# Altium project Warship_stm32f103zet6.PrjPcb
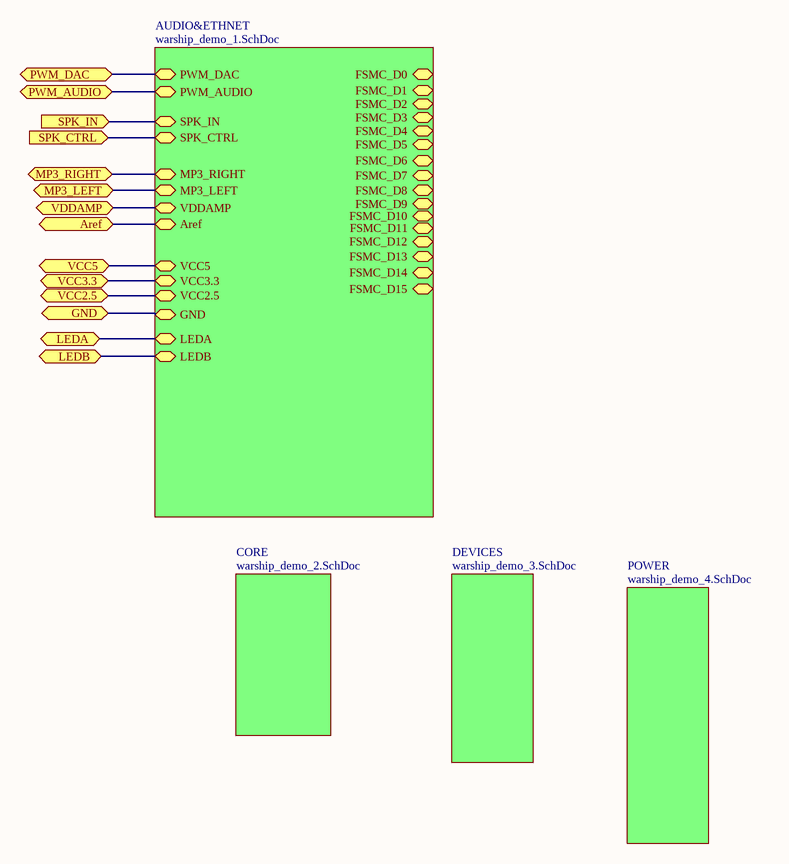
[diagram p0: top.SchDoc]
2 sheets, 53 parts. Net scope: global (net labels, ports and power ports of the same name join across sheets).
Board file: warship_demo_PCB.PcbDoc
Sheets:
  top.SchDoc
    CORE = warship_demo_2.SchDoc

## Sheet top.SchDoc
size A4

### Sub-sheets
AUDIO&ETHNET = warship_demo_1.SchDoc (file not in this document): PWM_DAC, PWM_AUDIO, SPK_IN, SPK_CTRL, MP3_RIGHT, MP3_LEFT, VDDAMP, Aref, VCC5, VCC3.3, VCC2.5, GND, LEDB, LEDA, FSMC_D0, FSMC_D1, FSMC_D2, FSMC_D3, FSMC_D4, FSMC_D5, FSMC_D6, FSMC_D7, FSMC_D8, FSMC_D9, FSMC_D10, FSMC_D11, FSMC_D12, FSMC_D13, FSMC_D14, FSMC_D15
CORE = warship_demo_2.SchDoc: no entries
DEVICES = warship_demo_3.SchDoc (file not in this document): no entries
POWER = warship_demo_4.SchDoc (file not in this document): no entries

### Ports
Aref, GND, LEDA, LEDB, MP3_LEFT, MP3_RIGHT, PWM_AUDIO, PWM_DAC, SPK_CTRL (in), SPK_IN (in), VCC2.5, VCC3.3, VCC5, VDDAMP

### Nets
(unnamed): port PWM_DAC, sheet AUDIO&ETHNET/PWM_DAC
(unnamed): port PWM_AUDIO, sheet AUDIO&ETHNET/PWM_AUDIO
(unnamed): port SPK_IN, sheet AUDIO&ETHNET/SPK_IN
(unnamed): port SPK_CTRL, sheet AUDIO&ETHNET/SPK_CTRL
(unnamed): port MP3_RIGHT, sheet AUDIO&ETHNET/MP3_RIGHT
(unnamed): port MP3_LEFT, sheet AUDIO&ETHNET/MP3_LEFT
(unnamed): port VDDAMP, sheet AUDIO&ETHNET/VDDAMP
(unnamed): port Aref, sheet AUDIO&ETHNET/Aref
(unnamed): port VCC5, sheet AUDIO&ETHNET/VCC5
(unnamed): port VCC3.3, sheet AUDIO&ETHNET/VCC3.3
(unnamed): port VCC2.5, sheet AUDIO&ETHNET/VCC2.5
(unnamed): port GND, sheet AUDIO&ETHNET/GND
(unnamed): port LEDA, sheet AUDIO&ETHNET/LEDA
(unnamed): port LEDB, sheet AUDIO&ETHNET/LEDB

## Sheet warship_demo_2.SchDoc
size A3
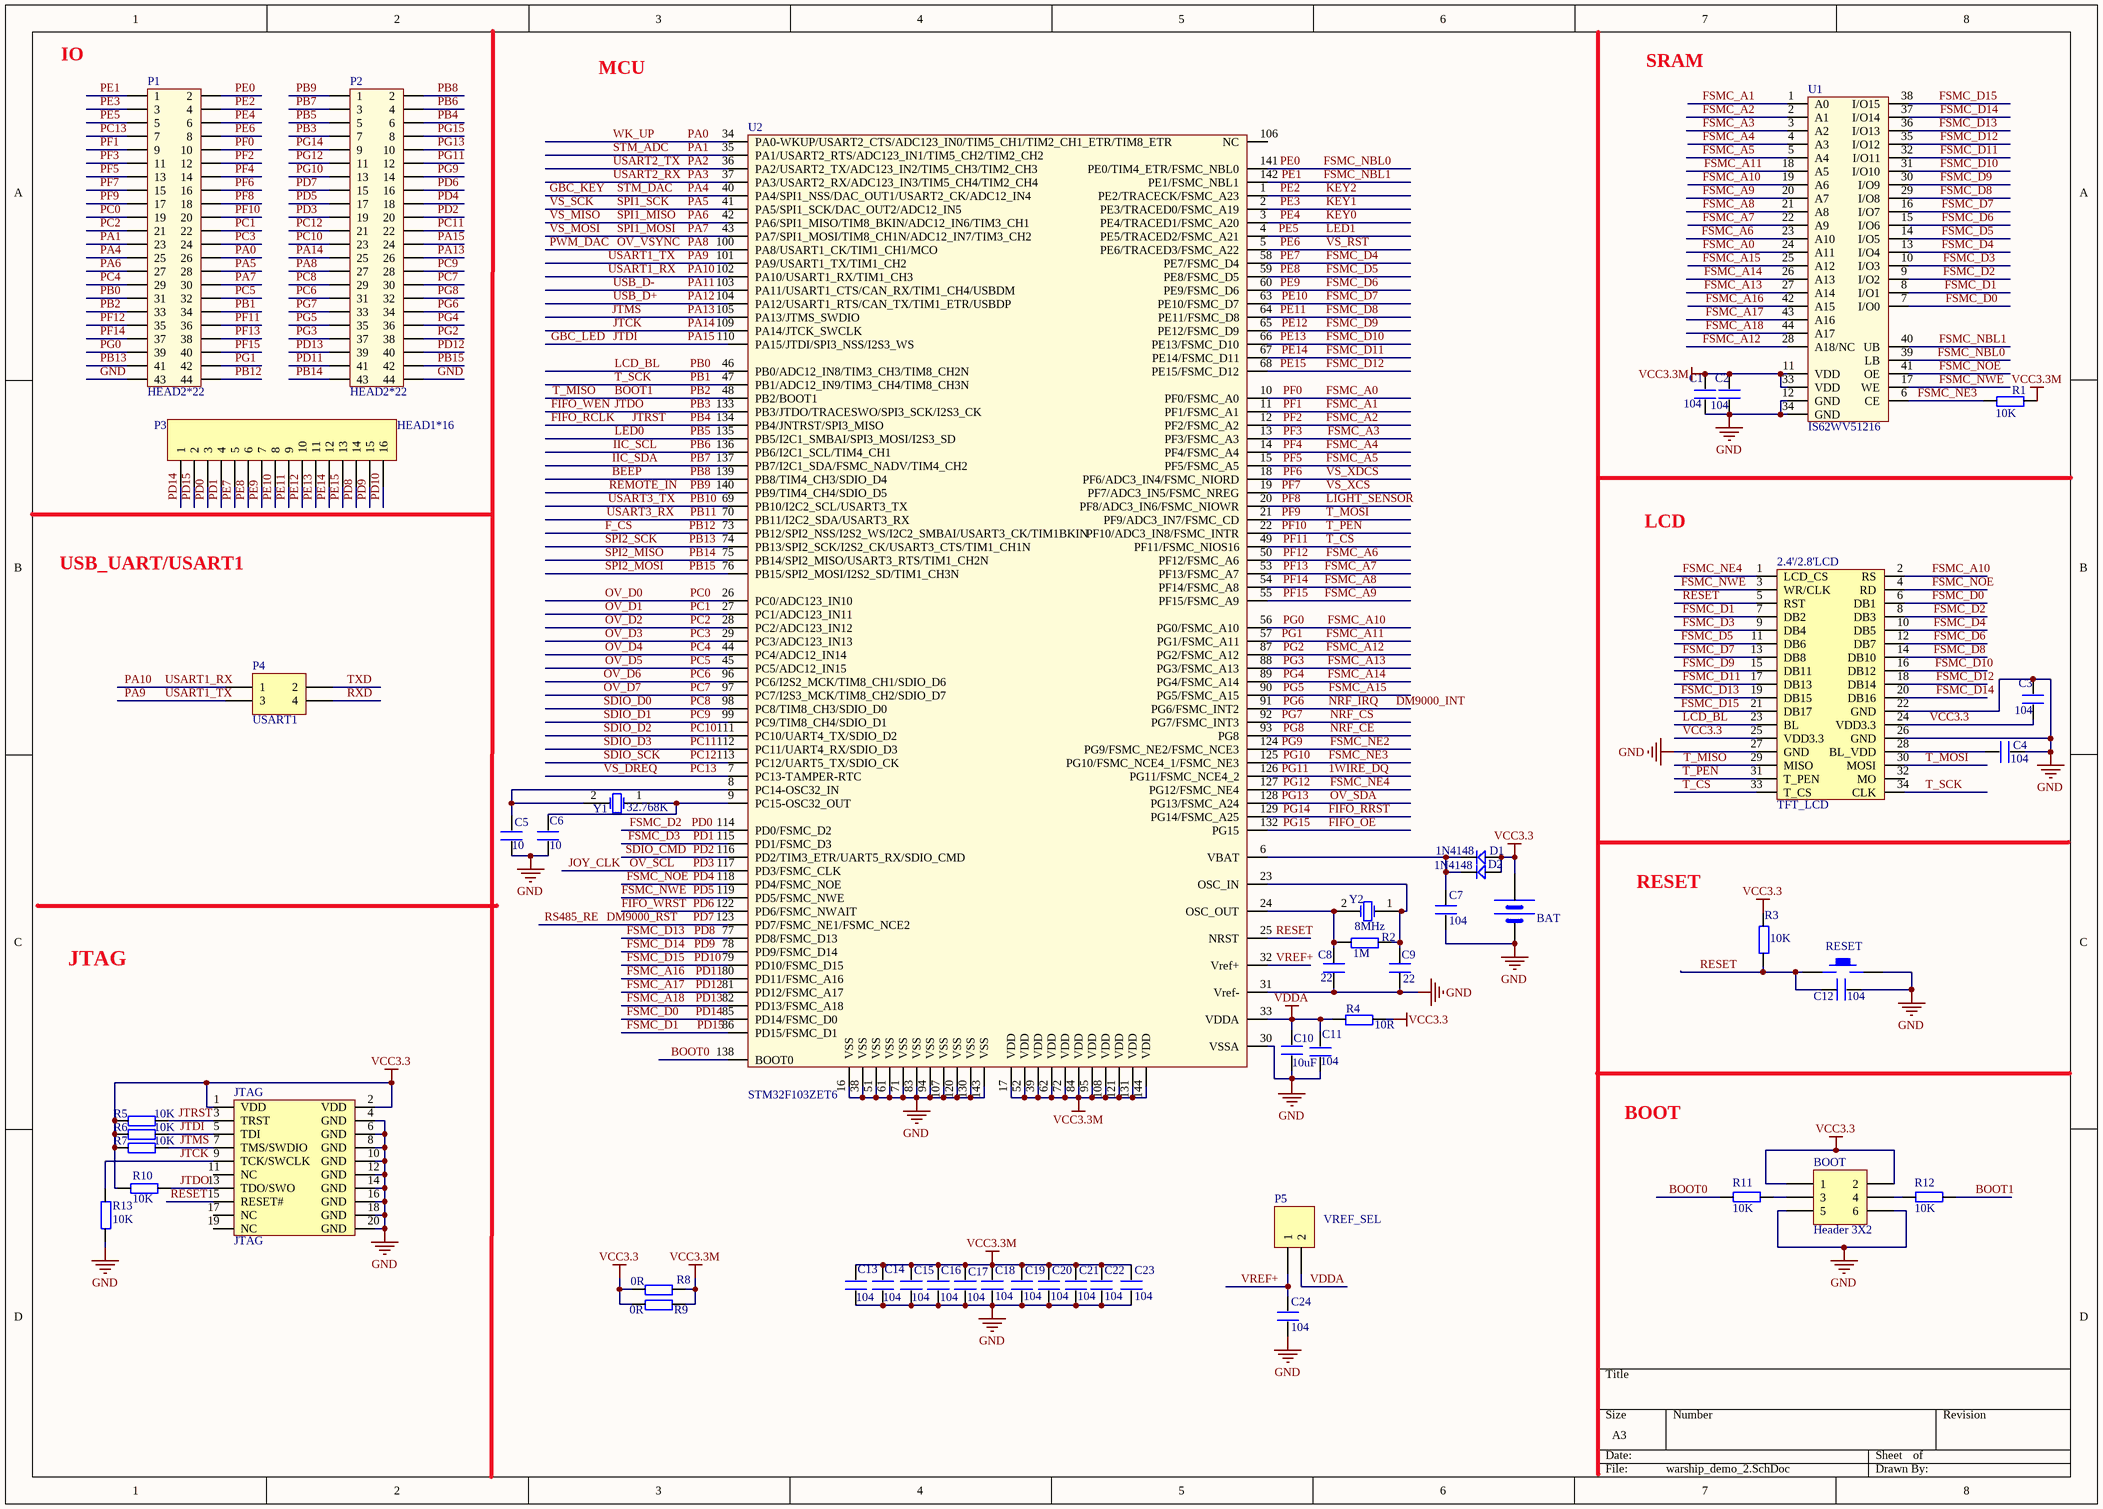
[diagram p1: warship_demo_2.SchDoc]

### Parts
2.4'/2.8'LCD  TFT_LCD  [db2*17-4.3]
BAT  BATT  [BATM]  (value not drawn)
BOOT  Header 3X2  [HDR2X3]
C1  104  [0603P]
C2  104  [0603P]
C3  104  [0603P]
C4  104  [0603P]
C5  10  [0603P]
C6  10  [0603P]
C7  104  [0603P]
C8  22  [0603P]
C9  22  [0603P]
C10  10uF  [0805]
C11  104  [0603P]
C12  104  [0603P]
C13  104  [0603P]
C14  104  [0603P]
C15  104  [0603P]
C16  104  [0603P]
C17  104  [0603P]
C18  104  [0603P]
C19  104  [0603P]
C20  104  [0603P]
C21  104  [0603P]
C22  104  [0603P]
C23  104  [0603P]
C24  104  [0603P]
D1  1N4148  [DIODE_SOP]
D2  1N4148  [DIODE_SOP]
JTAG  JTAG  [JTAG_20]
P1  HEAD2*22  [HEAD2*22]
P2  HEAD2*22  [HEAD2*22]
P3  HEAD1*16  [HDR1X16]
P4  USART1  [HDR2X2]
P5  VREF_SEL  [HDR1X2]
R1  10K  [0603P]
R2  1M  [0603P]
R3  10K  [0603P]
R4  10R  [0603P]
R5  10K  [0603P]
R6  10K  [0603P]
R7  10K  [0603P]
R8  0R  [0603P]
R9  0R  [0603P]
R10  10K  [0603P]
R11  10K  [0603P]
R12  10K  [0603P]
R13  10K  [0603P]
RESET  KEY_M  [KEY_M]  (value not drawn)
U1  IS62WV51216  [TSOP44]
U2  STM32F103ZET6  [LQFP144]
Y1  32.768K  [XTAL_US]
Y2  8MHz  [XTAL_US]

### Nets
GND: 2.4'/2.8'LCD.22(GND) 2.4'/2.8'LCD.26(GND) 2.4'/2.8'LCD.27(GND) BAT.2(GND) BOOT.5 BOOT.6 C1.1 C2.2 C3.1 C4.2 C5.1 C6.1 C7.1 C8.1 C9.2 C10.1 C11.2 C12.2 C13.1 C14.1 C15.1 C16.1 C17.1 C18.1 C19.1 C20.1 C21.1 C22.1 C23.1 C24.1 JTAG.4(GND) JTAG.6(GND) JTAG.8(GND) JTAG.10(GND) JTAG.12(GND) JTAG.14(GND) JTAG.16(GND) JTAG.18(GND) JTAG.20(GND) P1.43 P2.44 R13.1 RESET.2 U1.12(GND) U1.34(GND) U2.16(VSS) U2.30(VSSA) U2.31(Vref-) U2.38(VSS) U2.51(VSS) U2.61(VSS) U2.71(VSS) U2.83(VSS) U2.94(VSS) U2.107(VSS) U2.120(VSS) U2.130(VSS) U2.143(VSS)
VCC3.3: 2.4'/2.8'LCD.24(VDD3.3) 2.4'/2.8'LCD.25(VDD3.3) BAT.1(VCC) BOOT.1 BOOT.2 C3.2 D1.1 D2.1 JTAG.1(VDD) JTAG.2(VDD) R3.2 R4.2 R5.1 R6.1 R7.1 R8.1 R9.1 R10.1
VCC3.3M: C1.2 C2.1 C13.2 C14.2 C15.2 C16.2 C17.2 C18.2 C19.2 C20.2 C21.2 C22.2 C23.2 R1.2 R8.2 R9.2 U1.11(VDD) U1.33(VDD) U2.17(VDD) U2.39(VDD) U2.52(VDD) U2.62(VDD) U2.72(VDD) U2.84(VDD) U2.95(VDD) U2.108(VDD) U2.121(VDD) U2.131(VDD) U2.144(VDD)
VDDA: C10.2 C11.1 P5.2 R4.1 U2.33(VDDA)
1WIRE_DQ: P2.12 U2.126(PG11/FSMC_NCE4_2)  [also labelled PG11]
BEEP: P2.2 U2.139(PB8/TIM4_CH3/SDIO_D4)  [also labelled PB8]
BOOT0: R11.2 U2.138(BOOT0)
BOOT1: 2.4'/2.8'LCD.29(MISO) P1.33 R12.1 U2.48(PB2/BOOT1)  [also labelled PB2, T_MISO]
DM9000_INT: P2.34 U2.91(PG6/FSMC_INT2)  [also labelled NRF_IRQ, PG6]
DM9000_RST: P2.15 U2.123(PD7/FSMC_NE1/FSMC_NCE2)  [also labelled PD7, RS485_RE]
F_CS: P1.44 U2.73(PB12/SPI2_NSS/I2S2_WS/I2C2_SMBAI/USART3_CK/TIM1BKIN)  [also labelled PB12]
FIFO_OE: P2.8 U2.132(PG15)  [also labelled PG15]
FIFO_RCLK: JTAG.3(TRST) P2.6 R5.2 U2.134(PB4/JNTRST/SPI3_MISO)  [also labelled JTRST, PB4]
FIFO_RRST: P2.9 U2.129(PG14/FSMC_A25)  [also labelled PG14]
FIFO_WEN: JTAG.13(TDO/SWO) P2.7 R10.2 U2.133(PB3/JTDO/TRACESWO/SPI3_SCK/I2S3_CK)  [also labelled JTDO, PB3]
FIFO_WRST: P2.16 U2.122(PD6/FSMC_NWAIT)  [also labelled PD6]
FSMC_A0: P1.10 U1.24(A11) U2.10(PF0/FSMC_A0)  [also labelled PF0]
FSMC_A1: P1.9 U1.1(A0) U2.11(PF1/FSMC_A1)  [also labelled PF1]
FSMC_A2: P1.12 U1.2(A1) U2.12(PF2/FSMC_A2)  [also labelled PF2]
FSMC_A3: P1.11 U1.3(A2) U2.13(PF3/FSMC_A3)  [also labelled PF3]
FSMC_A4: P1.14 U1.4(A3) U2.14(PF4/FSMC_A4)  [also labelled PF4]
FSMC_A5: P1.13 U1.5(A4) U2.15(PF5/FSMC_A5)  [also labelled PF5]
FSMC_A6: P1.35 U1.23(A10) U2.50(PF12/FSMC_A6)  [also labelled PF12]
FSMC_A7: P1.38 U1.22(A9) U2.53(PF13/FSMC_A7)  [also labelled PF13]
FSMC_A8: P1.37 U1.21(A8) U2.54(PF14/FSMC_A8)  [also labelled PF14]
FSMC_A9: P1.40 U1.20(A7) U2.55(PF15/FSMC_A9)  [also labelled PF15]
FSMC_A10: 2.4'/2.8'LCD.2(RS) P1.39 U1.19(A6) U2.56(PG0/FSMC_A10)  [also labelled PG0]
FSMC_A11: P1.42 U1.18(A5) U2.57(PG1/FSMC_A11)  [also labelled PG1]
FSMC_A12: P2.38 U1.28(A18/NC) U2.87(PG2/FSMC_A12)  [also labelled PG2]
FSMC_A13: P2.37 U1.27(A14) U2.88(PG3/FSMC_A13)  [also labelled PG3]
FSMC_A14: P2.36 U1.26(A13) U2.89(PG4/FSMC_A14)  [also labelled PG4]
FSMC_A15: P2.35 U1.25(A12) U2.90(PG5/FSMC_A15)  [also labelled PG5]
FSMC_A16: P2.41 U1.42(A15) U2.80(PD11/FSMC_A16)  [also labelled PD11]
FSMC_A17: P2.40 U1.43(A16) U2.81(PD12/FSMC_A17)  [also labelled PD12]
FSMC_A18: P2.39 U1.44(A17) U2.82(PD13/FSMC_A18)  [also labelled PD13]
FSMC_D0: 2.4'/2.8'LCD.6(DB1) P3.1 U1.7(I/O0) U2.85(PD14/FSMC_D0)  [also labelled PD14]
FSMC_D1: 2.4'/2.8'LCD.7(DB2) P3.2 U1.8(I/O1) U2.86(PD15/FSMC_D1)  [also labelled PD15]
FSMC_D2: 2.4'/2.8'LCD.8(DB3) P3.3 U1.9(I/O2) U2.114(PD0/FSMC_D2)  [also labelled PD0]
FSMC_D3: 2.4'/2.8'LCD.9(DB4) P3.4 U1.10(I/O3) U2.115(PD1/FSMC_D3)  [also labelled PD1]
FSMC_D4: 2.4'/2.8'LCD.10(DB5) P3.5 U1.13(I/O4) U2.58(PE7/FSMC_D4)  [also labelled PE7]
FSMC_D5: 2.4'/2.8'LCD.11(DB6) P3.6 U1.14(I/O5) U2.59(PE8/FSMC_D5)  [also labelled PE8]
FSMC_D6: 2.4'/2.8'LCD.12(DB7) P3.7 U1.15(I/O6) U2.60(PE9/FSMC_D6)  [also labelled PE9]
FSMC_D7: 2.4'/2.8'LCD.13(DB8) P3.8 U1.16(I/O7) U2.63(PE10/FSMC_D7)  [also labelled PE10]
FSMC_D8: 2.4'/2.8'LCD.14(DB10) P3.9 U1.29(I/O8) U2.64(PE11/FSMC_D8)  [also labelled PE11]
FSMC_D9: 2.4'/2.8'LCD.15(DB11) P3.10 U1.30(I/O9) U2.65(PE12/FSMC_D9)  [also labelled PE12]
FSMC_D10: 2.4'/2.8'LCD.16(DB12) P3.11 U1.31(I/O10) U2.66(PE13/FSMC_D10)  [also labelled PE13]
FSMC_D11: 2.4'/2.8'LCD.17(DB13) P3.12 U1.32(I/O11) U2.67(PE14/FSMC_D11)  [also labelled PE14]
FSMC_D12: 2.4'/2.8'LCD.18(DB14) P3.13 U1.35(I/O12) U2.68(PE15/FSMC_D12)  [also labelled PE15]
FSMC_D13: 2.4'/2.8'LCD.19(DB15) P3.14 U1.36(I/O13) U2.77(PD8/FSMC_D13)  [also labelled PD8]
FSMC_D14: 2.4'/2.8'LCD.20(DB16) P3.15 U1.37(I/O14) U2.78(PD9/FSMC_D14)  [also labelled PD9]
FSMC_D15: 2.4'/2.8'LCD.21(DB17) P3.16 U1.38(I/O15) U2.79(PD10/FSMC_D15)  [also labelled PD10]
FSMC_NBL0: P1.2 U1.39(LB) U2.141(PE0/TIM4_ETR/FSMC_NBL0)  [also labelled PE0]
FSMC_NBL1: P1.1 U1.40(UB) U2.142(PE1/FSMC_NBL1)  [also labelled PE1]
FSMC_NE2: P2.14 U2.124(PG9/FSMC_NE2/FSMC_NCE3)  [also labelled PG9]
FSMC_NE3: P2.13 R1.1 U1.6(CE) U2.125(PG10/FSMC_NCE4_1/FSMC_NE3)  [also labelled PG10]
FSMC_NE4: 2.4'/2.8'LCD.1(LCD_CS) P2.11 U2.127(PG12/FSMC_NE4)  [also labelled PG12]
FSMC_NOE: 2.4'/2.8'LCD.4(RD) P2.18 U1.41(OE) U2.118(PD4/FSMC_NOE)  [also labelled PD4]
FSMC_NWE: 2.4'/2.8'LCD.3(WR/CLK) P2.17 U1.17(WE) U2.119(PD5/FSMC_NWE)  [also labelled PD5]
GBC_KEY: P1.25 U2.40(PA4/SPI1_NSS/DAC_OUT1/USART2_CK/ADC12_IN4)  [also labelled PA4, STM_DAC]
GBC_LED: JTAG.5(TDI) P2.24 R6.2 U2.110(PA15/JTDI/SPI3_NSS/I2S3_WS)  [also labelled JTDI, PA15]
IIC_SCL: P2.4 U2.136(PB6/I2C1_SCL/TIM4_CH1)  [also labelled PB6]
IIC_SDA: P2.3 U2.137(PB7/I2C1_SDA/FSMC_NADV/TIM4_CH2)  [also labelled PB7]
JOY_CLK: P2.19 U2.117(PD3/FSMC_CLK)  [also labelled OV_SCL, PD3]
JTCK: JTAG.9(TCK/SWCLK) P2.25 R13.2 U2.109(PA14/JTCK_SWCLK)  [also labelled PA14]
JTMS: JTAG.7(TMS/SWDIO) P2.26 R7.2 U2.105(PA13/JTMS_SWDIO)  [also labelled PA13]
KEY0: P1.6 U2.3(PE4/TRACED1/FSMC_A20)  [also labelled PE4]
KEY1: P1.3 U2.2(PE3/TRACED0/FSMC_A19)  [also labelled PE3]
KEY2: P1.4 U2.1(PE2/TRACECK/FSMC_A23)  [also labelled PE2]
LCD_BL: 2.4'/2.8'LCD.23(BL) P1.31 U2.46(PB0/ADC12_IN8/TIM3_CH3/TIM8_CH2N)  [also labelled PB0]
LED0: P2.5 U2.135(PB5/I2C1_SMBAI/SPI3_MOSI/I2S3_SD)  [also labelled PB5]
LED1: P1.5 U2.4(PE5/TRACED2/FSMC_A21)  [also labelled PE5]
LIGHT_SENSOR: P1.18 U2.20(PF8/ADC3_IN6/FSMC_NIOWR)  [also labelled PF8]
NRF_CE: P2.32 U2.93(PG8)  [also labelled PG8]
NRF_CS: P2.33 U2.92(PG7/FSMC_INT3)  [also labelled PG7]
OV_D0: P1.19 U2.26(PC0/ADC123_IN10)  [also labelled PC0]
OV_D1: P1.22 U2.27(PC1/ADC123_IN11)  [also labelled PC1]
OV_D2: P1.21 U2.28(PC2/ADC123_IN12)  [also labelled PC2]
OV_D3: P1.24 U2.29(PC3/ADC123_IN13)  [also labelled PC3]
OV_D4: P1.29 U2.44(PC4/ADC12_IN14)  [also labelled PC4]
OV_D5: P1.32 U2.45(PC5/ADC12_IN15)  [also labelled PC5]
OV_D6: P2.31 U2.96(PC6/I2S2_MCK/TIM8_CH1/SDIO_D6)  [also labelled PC6]
OV_D7: P2.30 U2.97(PC7/I2S3_MCK/TIM8_CH2/SDIO_D7)  [also labelled PC7]
OV_SDA: P2.10 U2.128(PG13/FSMC_A24)  [also labelled PG13]
OV_VSYNC: P2.27 U2.100(PA8/USART1_CK/TIM1_CH1/MCO)  [also labelled PA8, PWM_DAC]
PA0: P1.26 U2.34(PA0-WKUP/USART2_CTS/ADC123_IN0/TIM5_CH1/TIM2_CH1_ETR/TIM8_ETR)  [also labelled WK_UP]
PA1: P1.23 U2.35(PA1/USART2_RTS/ADC123_IN1/TIM5_CH2/TIM2_CH2)  [also labelled STM_ADC]
PA2: U2.36(PA2/USART2_TX/ADC123_IN2/TIM5_CH3/TIM2_CH3)  [also labelled USART2_TX]
PA3: U2.37(PA3/USART2_RX/ADC123_IN3/TIM5_CH4/TIM2_CH4)  [also labelled USART2_RX]
PA5: P1.28 U2.41(PA5/SPI1_SCK/DAC_OUT2/ADC12_IN5)  [also labelled SPI1_SCK, VS_SCK]
PA6: P1.27 U2.42(PA6/SPI1_MISO/TIM8_BKIN/ADC12_IN6/TIM3_CH1)  [also labelled SPI1_MISO, VS_MISO]
PA7: P1.30 U2.43(PA7/SPI1_MOSI/TIM8_CH1N/ADC12_IN7/TIM3_CH2)  [also labelled SPI1_MOSI, VS_MOSI]
PA9: P4.3 U2.101(PA9/USART1_TX/TIM1_CH2)  [also labelled USART1_TX]
PA10: P4.1 U2.102(PA10/USART1_RX/TIM1_CH3)  [also labelled USART1_RX]
PA11: U2.103(PA11/USART1_CTS/CAN_RX/TIM1_CH4/USBDM)  [also labelled USB_D-]
PA12: U2.104(PA12/USART1_RTS/CAN_TX/TIM1_ETR/USBDP)  [also labelled USB_D+]
PB1: 2.4'/2.8'LCD.34(CLK) P1.34 U2.47(PB1/ADC12_IN9/TIM3_CH4/TIM8_CH3N)  [also labelled T_SCK]
PB9: P2.1 U2.140(PB9/TIM4_CH4/SDIO_D5)  [also labelled REMOTE_IN]
PB10: U2.69(PB10/I2C2_SCL/USART3_TX)  [also labelled USART3_TX]
PB11: U2.70(PB11/I2C2_SDA/USART3_RX)  [also labelled USART3_RX]
PB13: P1.41 U2.74(PB13/SPI2_SCK/I2S2_CK/USART3_CTS/TIM1_CH1N)  [also labelled SPI2_SCK]
PB14: P2.43 U2.75(PB14/SPI2_MISO/USART3_RTS/TIM1_CH2N)  [also labelled SPI2_MISO]
PB15: P2.42 U2.76(PB15/SPI2_MOSI/I2S2_SD/TIM1_CH3N)  [also labelled SPI2_MOSI]
PC8: P2.29 U2.98(PC8/TIM8_CH3/SDIO_D0)  [also labelled SDIO_D0]
PC9: P2.28 U2.99(PC9/TIM8_CH4/SDIO_D1)  [also labelled SDIO_D1]
PC10: P2.23 U2.111(PC10/UART4_TX/SDIO_D2)  [also labelled SDIO_D2]
PC11: P2.22 U2.112(PC11/UART4_RX/SDIO_D3)  [also labelled SDIO_D3]
PC12: P2.21 U2.113(PC12/UART5_TX/SDIO_CK)  [also labelled SDIO_SCK]
PC13: P1.7 U2.7(PC13-TAMPER-RTC)  [also labelled VS_DREQ]
PD2: P2.20 U2.116(PD2/TIM3_ETR/UART5_RX/SDIO_CMD)  [also labelled SDIO_CMD]
PE6: P1.8 U2.5(PE6/TRACED3/FSMC_A22)  [also labelled VS_RST]
PF6: P1.16 U2.18(PF6/ADC3_IN4/FSMC_NIORD)  [also labelled VS_XDCS]
PF7: P1.15 U2.19(PF7/ADC3_IN5/FSMC_NREG)  [also labelled VS_XCS]
PF9: 2.4'/2.8'LCD.30(MOSI) P1.17 U2.21(PF9/ADC3_IN7/FSMC_CD)  [also labelled T_MOSI]
PF10: 2.4'/2.8'LCD.31(T_PEN) P1.20 U2.22(PF10/ADC3_IN8/FSMC_INTR)  [also labelled T_PEN]
PF11: 2.4'/2.8'LCD.33(T_CS) P1.36 U2.49(PF11/FSMC_NIOS16)  [also labelled T_CS]
RESET: 2.4'/2.8'LCD.5(RST) C12.1 JTAG.15(RESET#) R3.1 RESET.1 U2.25(NRST)
RXD: P4.4
TXD: P4.2
VREF+: C24.2 P5.1 U2.32(Vref+)
Net2.4'/2.8'LCD_28: 2.4'/2.8'LCD.28(BL_VDD) C4.1
NetBOOT_3: BOOT.3 R11.1
NetBOOT_4: BOOT.4 R12.2
NetC5_2: C5.2 U2.8(PC14-OSC32_IN) Y1.2(OSC2)
NetC6_2: C6.2 U2.9(PC15-OSC32_OUT) Y1.1(OSC1)
NetC7_2: C7.2 D1.2 D2.2 U2.6(VBAT)
NetC8_2: C8.2 R2.1 U2.24(OSC_OUT) Y2.2(OSC2)
NetC9_1: C9.1 R2.2 U2.23(OSC_IN) Y2.1(OSC1)

Not connected (* = marked no-connect by the designer): 2.4'/2.8'LCD 32(MO); JTAG 11(NC) 17(NC) 19(NC); U2 106(NC)

### Notes on the sheet
- IO
- MCU
- SRAM
- USB_UART/USART1
- LCD
- RESET
- JTAG
- BOOT

### Library data of the parts
BAT = BAT
BOOT = Header 3X2: Header, 3-Pin, Dual row; LatestRevisionDate: 17-Jul-2002; LatestRevisionNote: Re-released for DXP Platform.; Publisher: Altium Limited
C1-C24 = C
D1 D2 = D
P3 = Header 16: Header, 16-Pin; LatestRevisionDate: 17-Jul-2002; LatestRevisionNote: Re-released for DXP Platform.; Publisher: Altium Limited
P4 = Header 2X2: Header, 2-Pin, Dual row; LatestRevisionDate: 17-Jul-2002; LatestRevisionNote: Re-released for DXP Platform.; Publisher: Altium Limited
P5 = Header 2: Header, 2-Pin; LatestRevisionDate: 17-Jul-2002; LatestRevisionNote: Re-released for DXP Platform.; Publisher: Altium Limited
R1-R13 = R
U1 = IS61LV51216
Y1 Y2 = XTAL: Crystal Oscillator; Published: 8-Jun-2000; LatestRevisionDate: 17-Jul-2002; LatestRevisionNote: Re-released for DXP Platform.; Publisher: Altium Limited